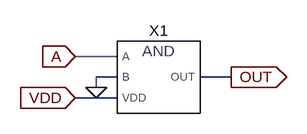
[diagram p0: schematic ClearCMOS.asc]
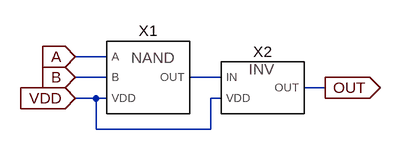
[diagram p1: sub-circuit andcmos.asc]
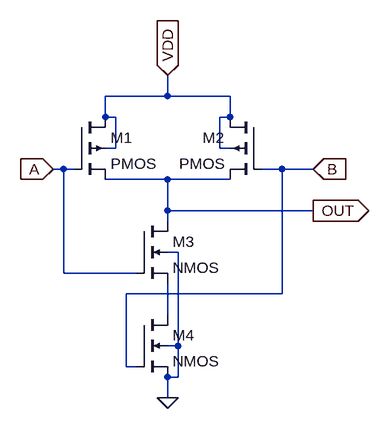
[diagram p2: sub-circuit nandcmos.asc]
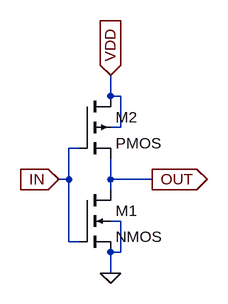
[diagram p3: sub-circuit invcmos.asc]
ClearCMOS.asc, the LTspice schematic file:
Version 4
SHEET 1 880 680
WIRE 144 112 80 112
WIRE 144 144 112 144
WIRE 320 144 272 144
WIRE 112 160 112 144
WIRE 144 176 80 176
FLAG 80 176 VDD
IOPIN 80 176 In
FLAG 80 112 A
IOPIN 80 112 In
FLAG 112 160 0
FLAG 320 144 OUT
IOPIN 320 144 Out
SYMBOL AndCMOS 208 144 R0
SYMATTR InstName X1

andcmos.asc, the sub-circuit schematic file:
Version 4
SHEET 1 880 680
WIRE 112 112 64 112
WIRE 112 144 64 144
WIRE 288 144 240 144
WIRE 448 160 416 160
WIRE 96 176 64 176
WIRE 112 176 96 176
WIRE 288 176 272 176
WIRE 96 224 96 176
WIRE 272 224 272 176
WIRE 272 224 96 224
FLAG 64 112 A
IOPIN 64 112 In
FLAG 64 144 B
IOPIN 64 144 In
FLAG 64 176 VDD
IOPIN 64 176 In
FLAG 448 160 OUT
IOPIN 448 160 Out
SYMBOL NandCMOS 176 144 R0
SYMATTR InstName X1
SYMBOL InvCMOS 352 160 R0
SYMATTR InstName X2

nandcmos.asc, the sub-circuit schematic file:
Version 4
SHEET 1 880 680
WIRE -112 -160 -112 -192
WIRE -112 -160 -208 -160
WIRE -16 -160 -112 -160
WIRE -208 -128 -208 -160
WIRE -192 -128 -208 -128
WIRE -16 -128 -16 -160
WIRE -16 -128 -32 -128
WIRE -192 -80 -192 -128
WIRE -192 -80 -208 -80
WIRE -32 -80 -32 -128
WIRE -16 -80 -32 -80
WIRE -272 -48 -288 -48
WIRE -256 -48 -272 -48
WIRE 64 -48 32 -48
WIRE 112 -48 64 -48
WIRE -112 -32 -208 -32
WIRE -16 -32 -112 -32
WIRE -112 16 -112 -32
WIRE 112 16 -112 16
WIRE -112 32 -112 16
WIRE -96 80 -112 80
WIRE -272 112 -272 -48
WIRE -160 112 -272 112
WIRE 64 144 64 -48
WIRE 64 144 -176 144
WIRE -112 176 -112 128
WIRE -96 224 -96 80
WIRE -96 224 -112 224
WIRE -176 256 -176 144
WIRE -160 256 -176 256
WIRE -96 272 -96 224
WIRE -96 272 -112 272
WIRE -112 304 -112 272
FLAG -112 304 0
FLAG -112 -192 VDD
IOPIN -112 -192 In
FLAG -288 -48 A
IOPIN -288 -48 In
FLAG 112 -48 B
IOPIN 112 -48 In
FLAG 112 16 OUT
IOPIN 112 16 Out
SYMBOL pmos4 -256 -128 R0
SYMATTR InstName M1
SYMATTR Value2 l=65nm w=162.5nm
SYMBOL pmos4 32 -128 M0
SYMATTR InstName M2
SYMATTR Value2 l=65nm w=162.5nm
SYMBOL nmos4 -160 32 R0
SYMATTR InstName M3
SYMATTR Value2 l=65nm w=65nm
SYMBOL nmos4 -160 176 R0
SYMATTR InstName M4
SYMATTR Value2 l=65nm w=65nm

invcmos.asc, the sub-circuit schematic file:
Version 4
SHEET 1 880 680
WIRE 208 32 208 0
WIRE 224 32 208 32
WIRE 224 80 224 32
WIRE 224 80 208 80
WIRE 160 112 144 112
WIRE 144 160 144 112
WIRE 144 160 128 160
WIRE 208 160 208 128
WIRE 272 160 208 160
WIRE 208 176 208 160
WIRE 224 224 208 224
WIRE 144 256 144 160
WIRE 160 256 144 256
WIRE 224 272 224 224
WIRE 224 272 208 272
WIRE 208 304 208 272
FLAG 208 304 0
FLAG 208 0 VDD
IOPIN 208 0 In
FLAG 128 160 IN
IOPIN 128 160 In
FLAG 272 160 OUT
IOPIN 272 160 Out
SYMBOL nmos4 160 176 R0
SYMATTR InstName M1
SYMATTR Value2 l=65nm w=65nm
SYMBOL pmos4 160 32 R0
SYMATTR InstName M2
SYMATTR Value2 l=65nm w=162.5nm

The netlist it stands for:
* ClearCMOS.asc
XX1 A 0 VDD OUT andcmos

* block symbol definitions
.subckt andcmos A B VDD OUT
XX1 A B VDD N001 nandcmos
XX2 N001 VDD OUT invcmos
.ends andcmos

.subckt nandcmos A B VDD OUT
M1 VDD A OUT VDD PMOS l=65nm w=162.5nm
M2 VDD B OUT VDD PMOS l=65nm w=162.5nm
M3 OUT A N001 0 NMOS l=65nm w=65nm
M4 N001 B 0 0 NMOS l=65nm w=65nm
.ends nandcmos

.subckt invcmos IN VDD OUT
M1 OUT IN 0 0 NMOS l=65nm w=65nm
M2 VDD IN OUT VDD PMOS l=65nm w=162.5nm
.ends invcmos

.model NMOS NMOS
.model PMOS PMOS
.lib standard.mos
.backanno
.end